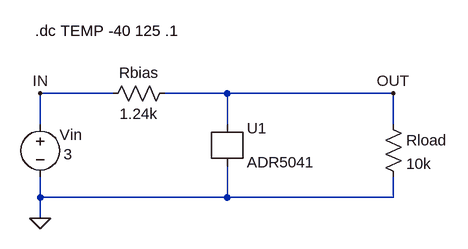
[diagram p0: schematic ADR5041.asc]
ADR5041.asc, the LTspice schematic file:
Version 4
SHEET 1 880 960
WIRE 32 64 -80 64
WIRE 208 64 112 64
WIRE 464 64 208 64
WIRE -80 112 -80 64
WIRE 208 112 208 64
WIRE 464 112 464 64
WIRE -80 224 -80 192
WIRE 208 224 208 176
WIRE 208 224 -80 224
WIRE 464 224 464 192
WIRE 464 224 208 224
WIRE -80 256 -80 224
FLAG -80 64 IN
FLAG -80 256 0
FLAG 464 64 OUT
SYMBOL res 448 96 R0
SYMATTR InstName Rload
SYMATTR Value 10k
SYMBOL res 16 80 R270
WINDOW 0 32 56 VTop 2
WINDOW 3 0 56 VBottom 2
SYMATTR InstName Rbias
SYMATTR Value 1.24k
SYMBOL voltage -80 96 R0
WINDOW 3 36 62 Left 2
WINDOW 123 0 0 Left 0
WINDOW 39 0 0 Left 0
WINDOW 0 30 32 Left 2
SYMATTR Value 3
SYMATTR InstName Vin
SYMBOL ADR5041 208 144 R0
SYMATTR InstName U1
TEXT -88 -32 Left 2 !.dc TEMP -40 125 .1

The netlist it stands for:
* ADR5041.asc
Rload OUT 0 10k
Rbias IN OUT 1.24k
Vin IN 0 3
XU1 OUT 0 ADR5041
.dc TEMP -40 125 .1
.lib ADR5041.sub
.backanno
.end